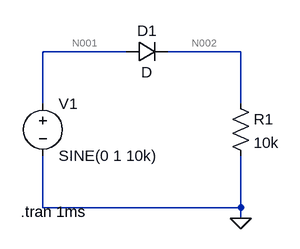
[diagram p0: schematic q1.asc]
q1.asc, the LTspice schematic file:
Version 4
SHEET 1 880 680
WIRE 208 64 80 64
WIRE 384 64 272 64
WIRE 80 144 80 64
WIRE 384 144 384 64
WIRE 80 304 80 224
WIRE 384 304 384 224
WIRE 384 304 80 304
WIRE 384 320 384 304
FLAG 384 320 0
SYMBOL voltage 80 128 R0
WINDOW 123 0 0 Left 0
WINDOW 39 0 0 Left 0
SYMATTR InstName V1
SYMATTR Value SINE(0 1 10k)
SYMBOL diode 208 80 R270
WINDOW 0 32 32 VTop 2
WINDOW 3 0 32 VBottom 2
SYMATTR InstName D1
SYMBOL res 368 128 R0
SYMATTR InstName R1
SYMATTR Value 10k
TEXT 46 310 Left 2 !.tran 1ms

The netlist it stands for:
* q1.asc
V1 N001 0 SINE(0 1 10k)
D1 N001 N002 D
R1 N002 0 10k
.model D D
.lib standard.dio
.tran 1ms
.backanno
.end

* Results of the author's LTspice run, read from the files saved beside the schematic
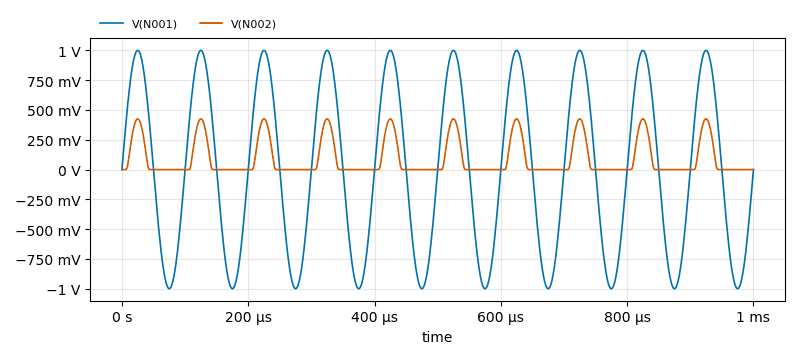
[diagram p1: Transient Analysis of q1.asc, plotted from the saved traces]
* Transient Analysis, 1 run:
*   V(N001): min -1 V, max 1 V, average 266.1 µV, rms 707.2 mV, last 0 V
*   V(N002): min 0 V, max 425.6 mV, average 90.44 mV, rms 173.6 mV, last 0 V